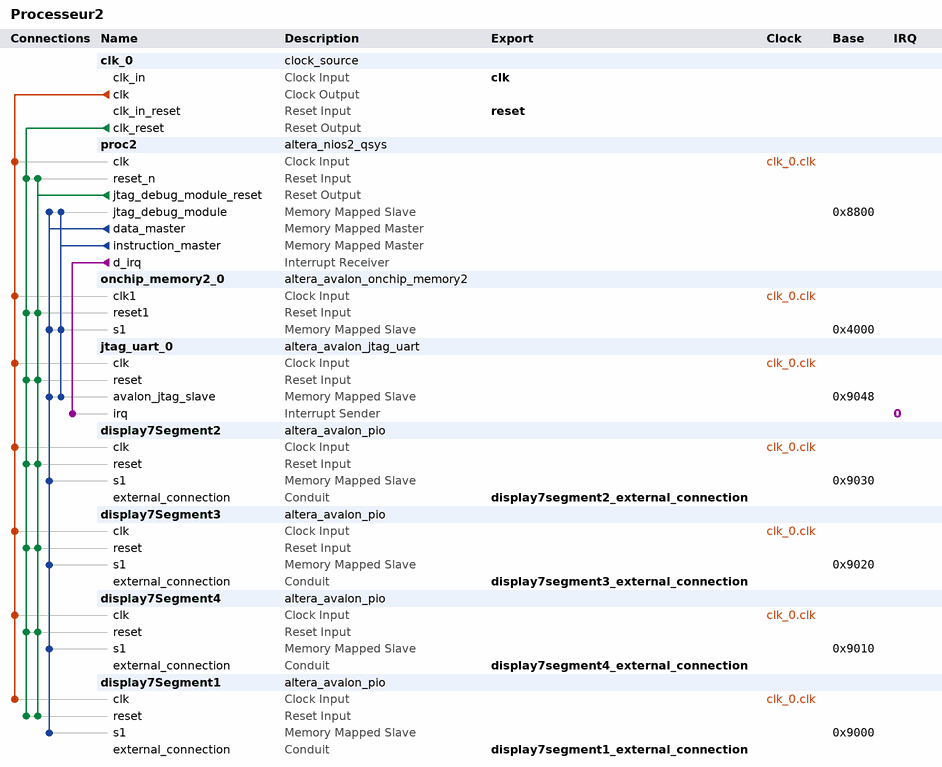
[diagram p0: system contents]
# Platform Designer (Qsys) system Processeur2, Cyclone II EP2C20F484C7
# Parameters at their usual value, and those the tool derives, are not listed.
package require -exact qsys 13.0.1.99.2
create_system Processeur2
set_project_property DEVICE_FAMILY {Cyclone II}
set_project_property DEVICE EP2C20F484C7

add_instance clk_0 clock_source 13.0
set_instance_parameter_value clk_0 clockFrequency 50000000

add_instance proc2 altera_nios2_qsys 13.0
set_instance_parameter_value proc2 resetSlave onchip_memory2_0.s1
set_instance_parameter_value proc2 mmu_TLBMissExcSlave None
set_instance_parameter_value proc2 exceptionSlave onchip_memory2_0.s1
set_instance_parameter_value proc2 breakSlave proc2.jtag_debug_module
set_instance_parameter_value proc2 impl Tiny
set_instance_parameter_value proc2 icache_size 4096

add_instance onchip_memory2_0 altera_avalon_onchip_memory2 13.0.1.99.2
set_instance_parameter_value onchip_memory2_0 dataWidth 32
set_instance_parameter_value onchip_memory2_0 dualPort false
set_instance_parameter_value onchip_memory2_0 initMemContent true
set_instance_parameter_value onchip_memory2_0 initializationFileName onchip_mem.hex
set_instance_parameter_value onchip_memory2_0 memorySize 10240

add_instance jtag_uart_0 altera_avalon_jtag_uart 13.0.1.99.2
set_instance_parameter_value jtag_uart_0 simInteractiveOptions NO_INTERACTIVE_WINDOWS

add_instance display7Segment2 altera_avalon_pio 13.0.1.99.2
set_instance_parameter_value display7Segment2 direction Output
set_instance_parameter_value display7Segment2 width 7

add_instance display7Segment3 altera_avalon_pio 13.0.1.99.2
set_instance_parameter_value display7Segment3 direction Output
set_instance_parameter_value display7Segment3 width 7

add_instance display7Segment4 altera_avalon_pio 13.0.1.99.2
set_instance_parameter_value display7Segment4 direction Output
set_instance_parameter_value display7Segment4 width 7

add_instance display7Segment1 altera_avalon_pio 13.0.1.99.2
set_instance_parameter_value display7Segment1 direction Output
set_instance_parameter_value display7Segment1 width 7

# connections
add_connection clk_0.clk display7Segment1.clk clock
add_connection clk_0.clk display7Segment2.clk clock
add_connection clk_0.clk display7Segment3.clk clock
add_connection clk_0.clk display7Segment4.clk clock
add_connection clk_0.clk jtag_uart_0.clk clock
add_connection clk_0.clk onchip_memory2_0.clk1 clock
add_connection clk_0.clk proc2.clk clock
add_connection clk_0.clk_reset display7Segment1.reset reset
add_connection clk_0.clk_reset display7Segment2.reset reset
add_connection clk_0.clk_reset display7Segment3.reset reset
add_connection clk_0.clk_reset display7Segment4.reset reset
add_connection clk_0.clk_reset jtag_uart_0.reset reset
add_connection clk_0.clk_reset onchip_memory2_0.reset1 reset
add_connection clk_0.clk_reset proc2.reset_n reset
add_connection proc2.jtag_debug_module_reset display7Segment1.reset reset
add_connection proc2.jtag_debug_module_reset display7Segment2.reset reset
add_connection proc2.jtag_debug_module_reset display7Segment3.reset reset
add_connection proc2.jtag_debug_module_reset display7Segment4.reset reset
add_connection proc2.jtag_debug_module_reset jtag_uart_0.reset reset
add_connection proc2.jtag_debug_module_reset onchip_memory2_0.reset1 reset
add_connection proc2.jtag_debug_module_reset proc2.reset_n reset
add_connection proc2.data_master display7Segment1.s1 avalon
set_connection_parameter_value proc2.data_master/display7Segment1.s1 baseAddress 0x9000
add_connection proc2.data_master display7Segment2.s1 avalon
set_connection_parameter_value proc2.data_master/display7Segment2.s1 baseAddress 0x9030
add_connection proc2.data_master display7Segment3.s1 avalon
set_connection_parameter_value proc2.data_master/display7Segment3.s1 baseAddress 0x9020
add_connection proc2.data_master display7Segment4.s1 avalon
set_connection_parameter_value proc2.data_master/display7Segment4.s1 baseAddress 0x9010
add_connection proc2.data_master jtag_uart_0.avalon_jtag_slave avalon
set_connection_parameter_value proc2.data_master/jtag_uart_0.avalon_jtag_slave baseAddress 0x9048
add_connection proc2.data_master onchip_memory2_0.s1 avalon
set_connection_parameter_value proc2.data_master/onchip_memory2_0.s1 baseAddress 0x4000
add_connection proc2.data_master proc2.jtag_debug_module avalon
set_connection_parameter_value proc2.data_master/proc2.jtag_debug_module baseAddress 0x8800
add_connection proc2.instruction_master jtag_uart_0.avalon_jtag_slave avalon
set_connection_parameter_value proc2.instruction_master/jtag_uart_0.avalon_jtag_slave baseAddress 0x9048
add_connection proc2.instruction_master onchip_memory2_0.s1 avalon
set_connection_parameter_value proc2.instruction_master/onchip_memory2_0.s1 baseAddress 0x4000
add_connection proc2.instruction_master proc2.jtag_debug_module avalon
set_connection_parameter_value proc2.instruction_master/proc2.jtag_debug_module baseAddress 0x8800
add_connection proc2.d_irq jtag_uart_0.irq interrupt
set_connection_parameter_value proc2.d_irq/jtag_uart_0.irq irqNumber 0

# exported interfaces
add_interface clk clock sink
set_interface_property clk EXPORT_OF clk_0.clk_in
add_interface reset reset sink
set_interface_property reset EXPORT_OF clk_0.clk_in_reset
add_interface display7segment2_external_connection conduit end
set_interface_property display7segment2_external_connection EXPORT_OF display7Segment2.external_connection
add_interface display7segment3_external_connection conduit end
set_interface_property display7segment3_external_connection EXPORT_OF display7Segment3.external_connection
add_interface display7segment4_external_connection conduit end
set_interface_property display7segment4_external_connection EXPORT_OF display7Segment4.external_connection
add_interface display7segment1_external_connection conduit end
set_interface_property display7segment1_external_connection EXPORT_OF display7Segment1.external_connection

set_interconnect_requirement {$system} qsys_mm.clockCrossingAdapter HANDSHAKE
set_interconnect_requirement {$system} qsys_mm.maxAdditionalLatency 1

save_system Processeur2.qsys
